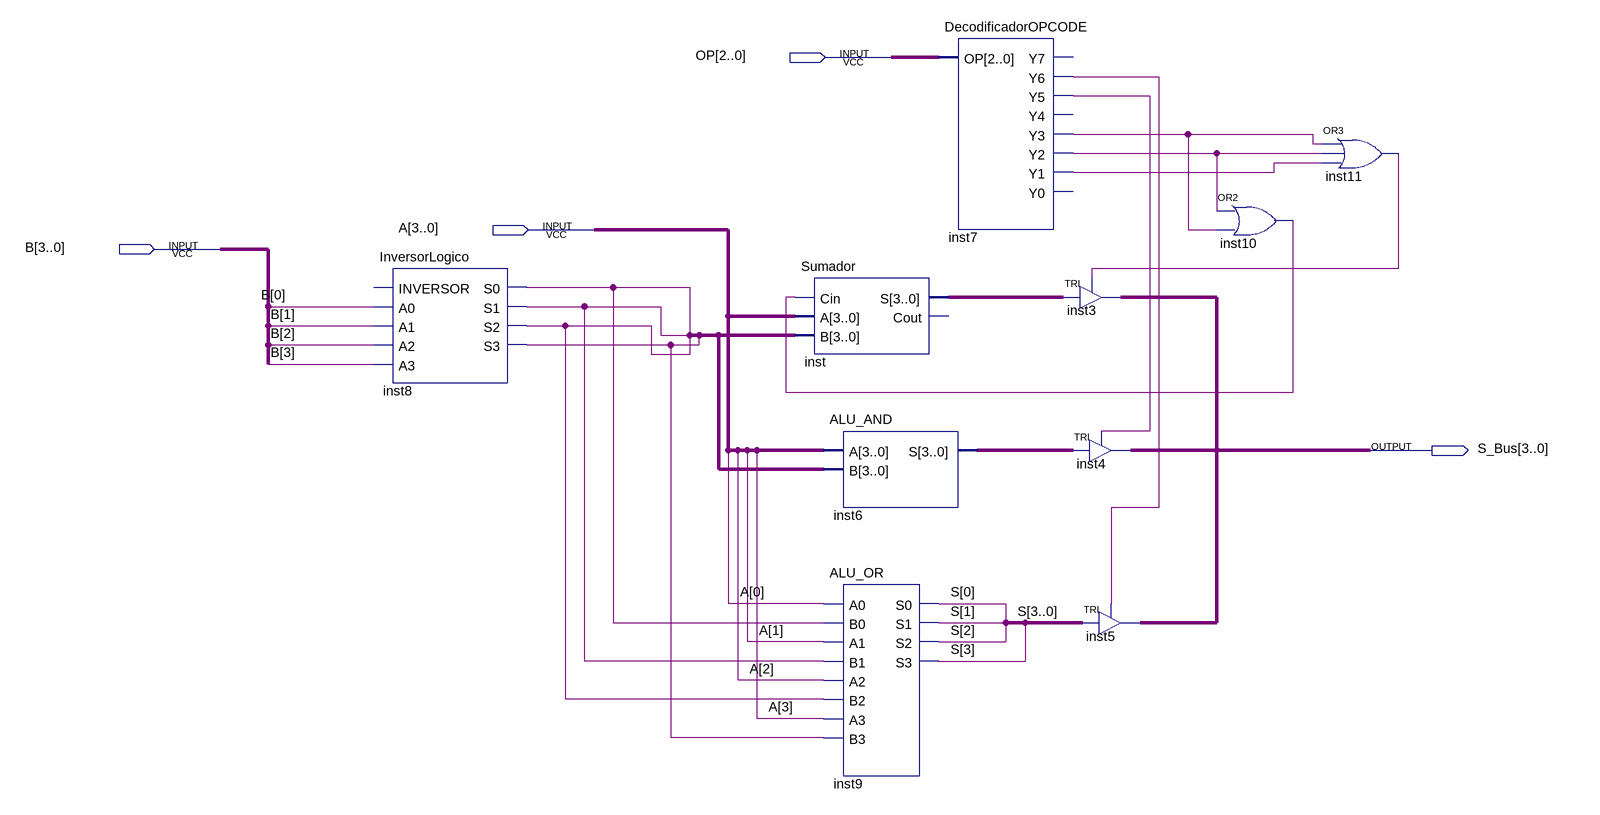
[diagram p0: schematic sheet]
// Quartus schematic Bus_de_Resultado.bdf as structural Verilog: 10 symbols, 4 pins
module Bus_de_Resultado (
  input  [2:0] OP,
  input  [3:0] A,
  input  [3:0] B,
  output [3:0] S_Bus
);

  wire inst7_y1, inst7_y2, inst7_y3, inst7_y5, inst7_y6, inst8_s0, inst8_s3, inst10_out, inst11_out;
  wire [3:0] inst6_s, inst_s, S, undriven;

  InversorLogico inst8 (
    .A0(B[0]), .A1(B[1]), .A2(B[2]), .A3(B[3]), .S0(inst8_s0), .S1(inst8_s0), .S2(inst8_s0), .S3(inst8_s3));  // open: INVERSOR
  Sumador inst (.Cin(inst10_out), .A(A), .B(undriven), .S(inst_s));  // open: Cout
  ALU_AND inst6 (.A(A), .B(undriven), .S(inst6_s));
  ALU_OR inst9 (
    .A0(A[0]), .B0(inst8_s0), .A1(A[1]), .B1(inst8_s0), .A2(A[2]), .B2(inst8_s0), .A3(A[3]), .B3(inst8_s3),
    .S0(S[0]), .S1(S[1]), .S2(S[2]), .S3(S[3]));
  DecodificadorOPCODE inst7 (
    .OP(OP), .Y6(inst7_y6), .Y5(inst7_y5), .Y3(inst7_y3), .Y2(inst7_y2), .Y1(inst7_y1));  // open: Y7, Y4, Y0
  TRI inst3[3:0] (.IN(inst_s), .OE(inst11_out), .OUT(S_Bus));
  TRI inst4[3:0] (.IN(inst6_s), .OE(inst7_y5), .OUT(S_Bus));
  TRI inst5[3:0] (.IN(S), .OE(inst7_y6), .OUT(S_Bus));
  or inst10 (inst10_out, inst7_y2, inst7_y3);
  or inst11 (inst11_out, inst7_y3, inst7_y2, inst7_y1);
endmodule
